# EAGLE board LLS16 (EAGLE 9.6.2), part 1 of 5
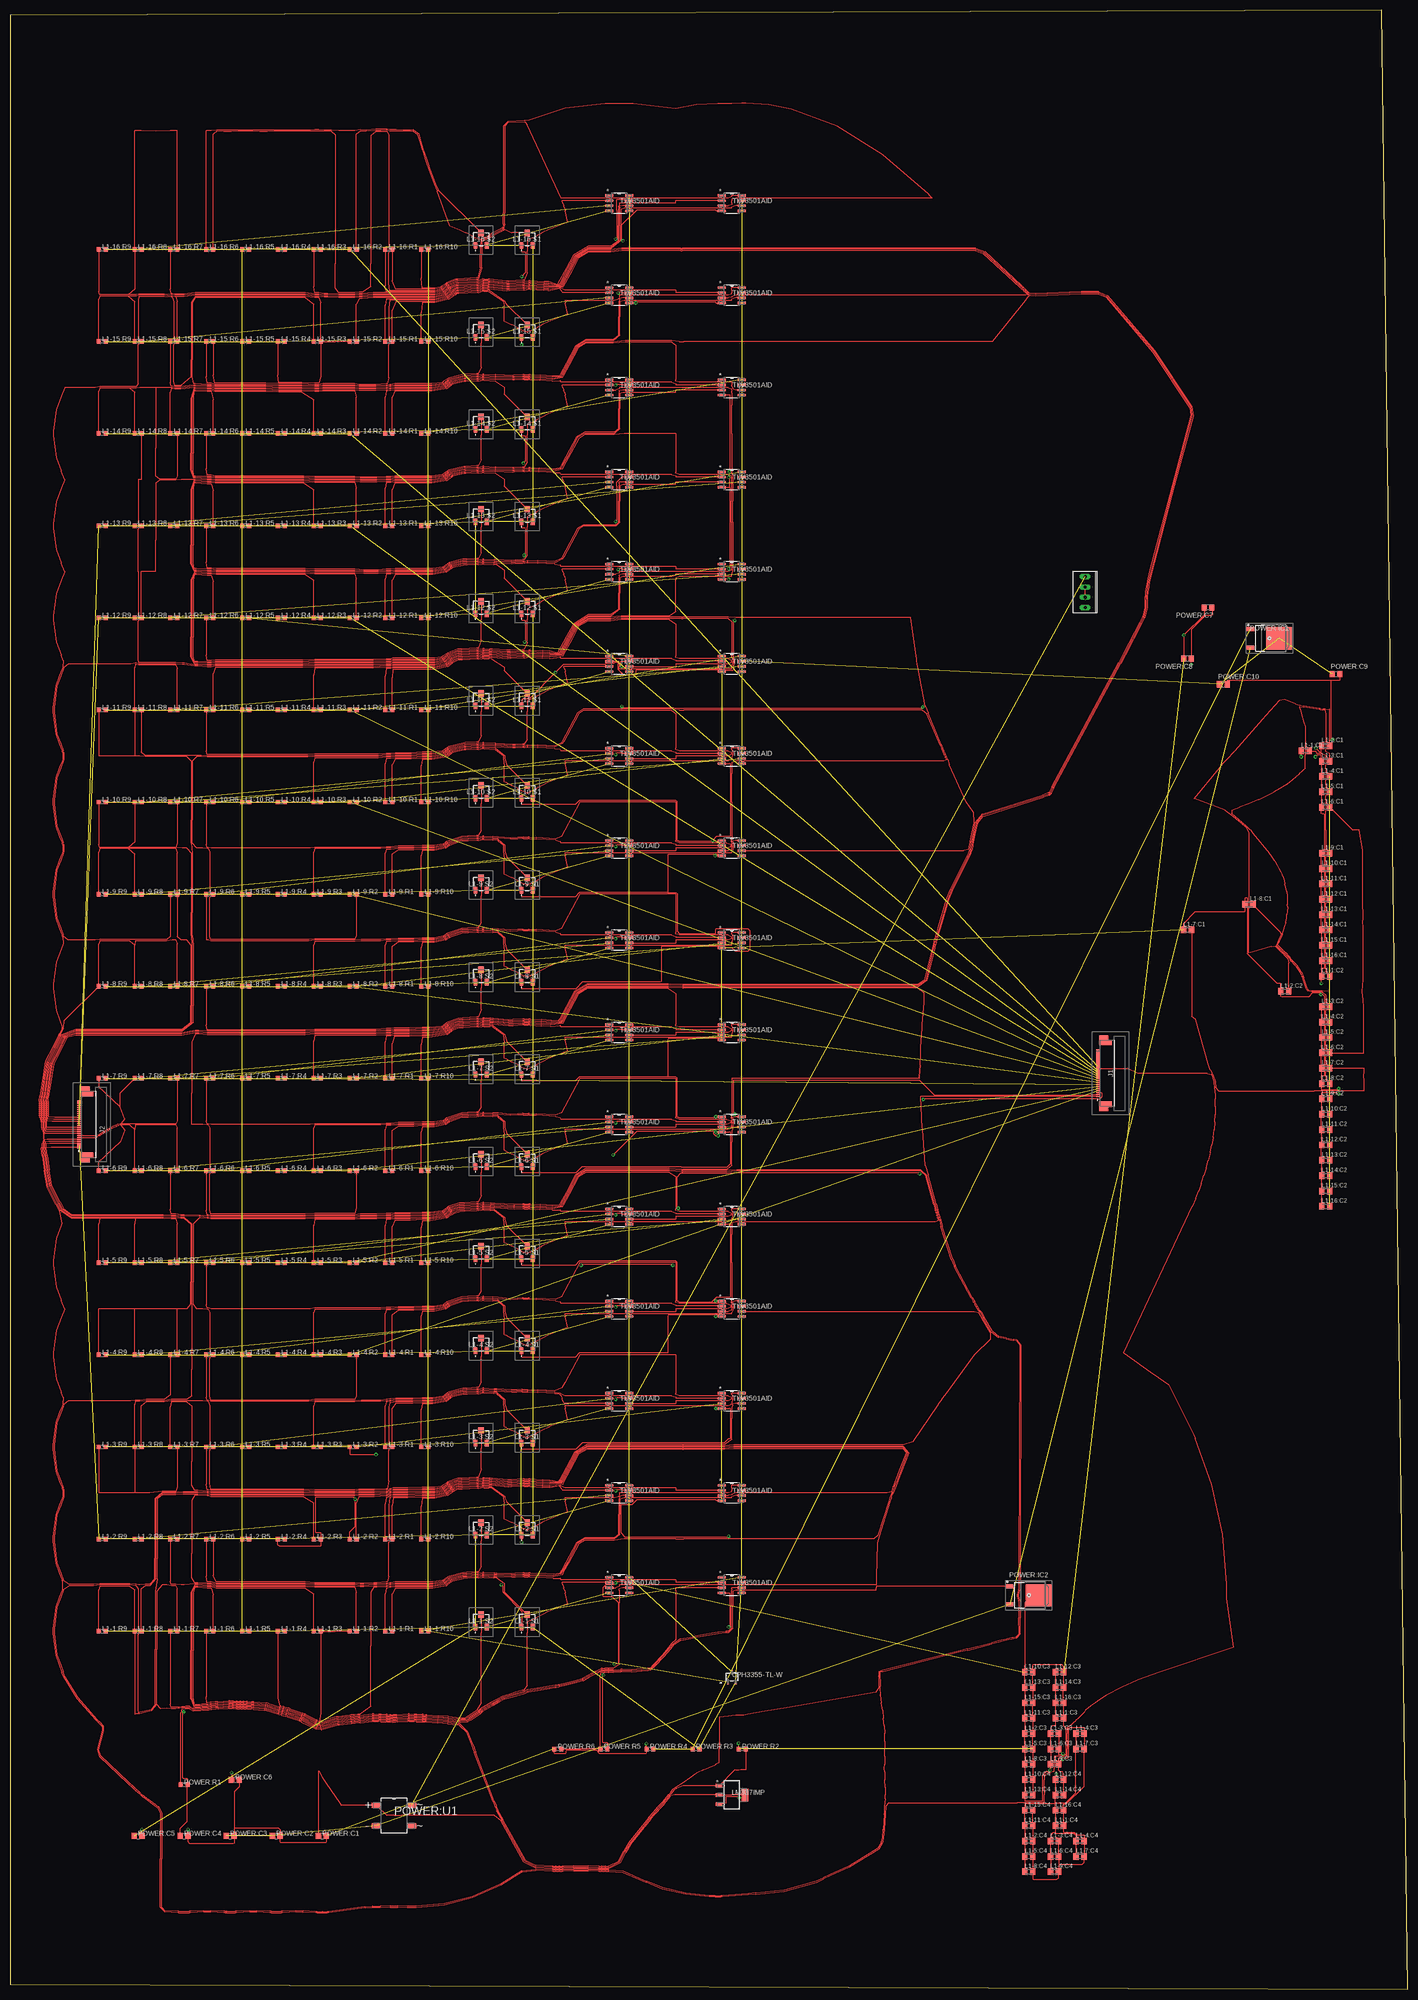
[diagram p3: board, top side]
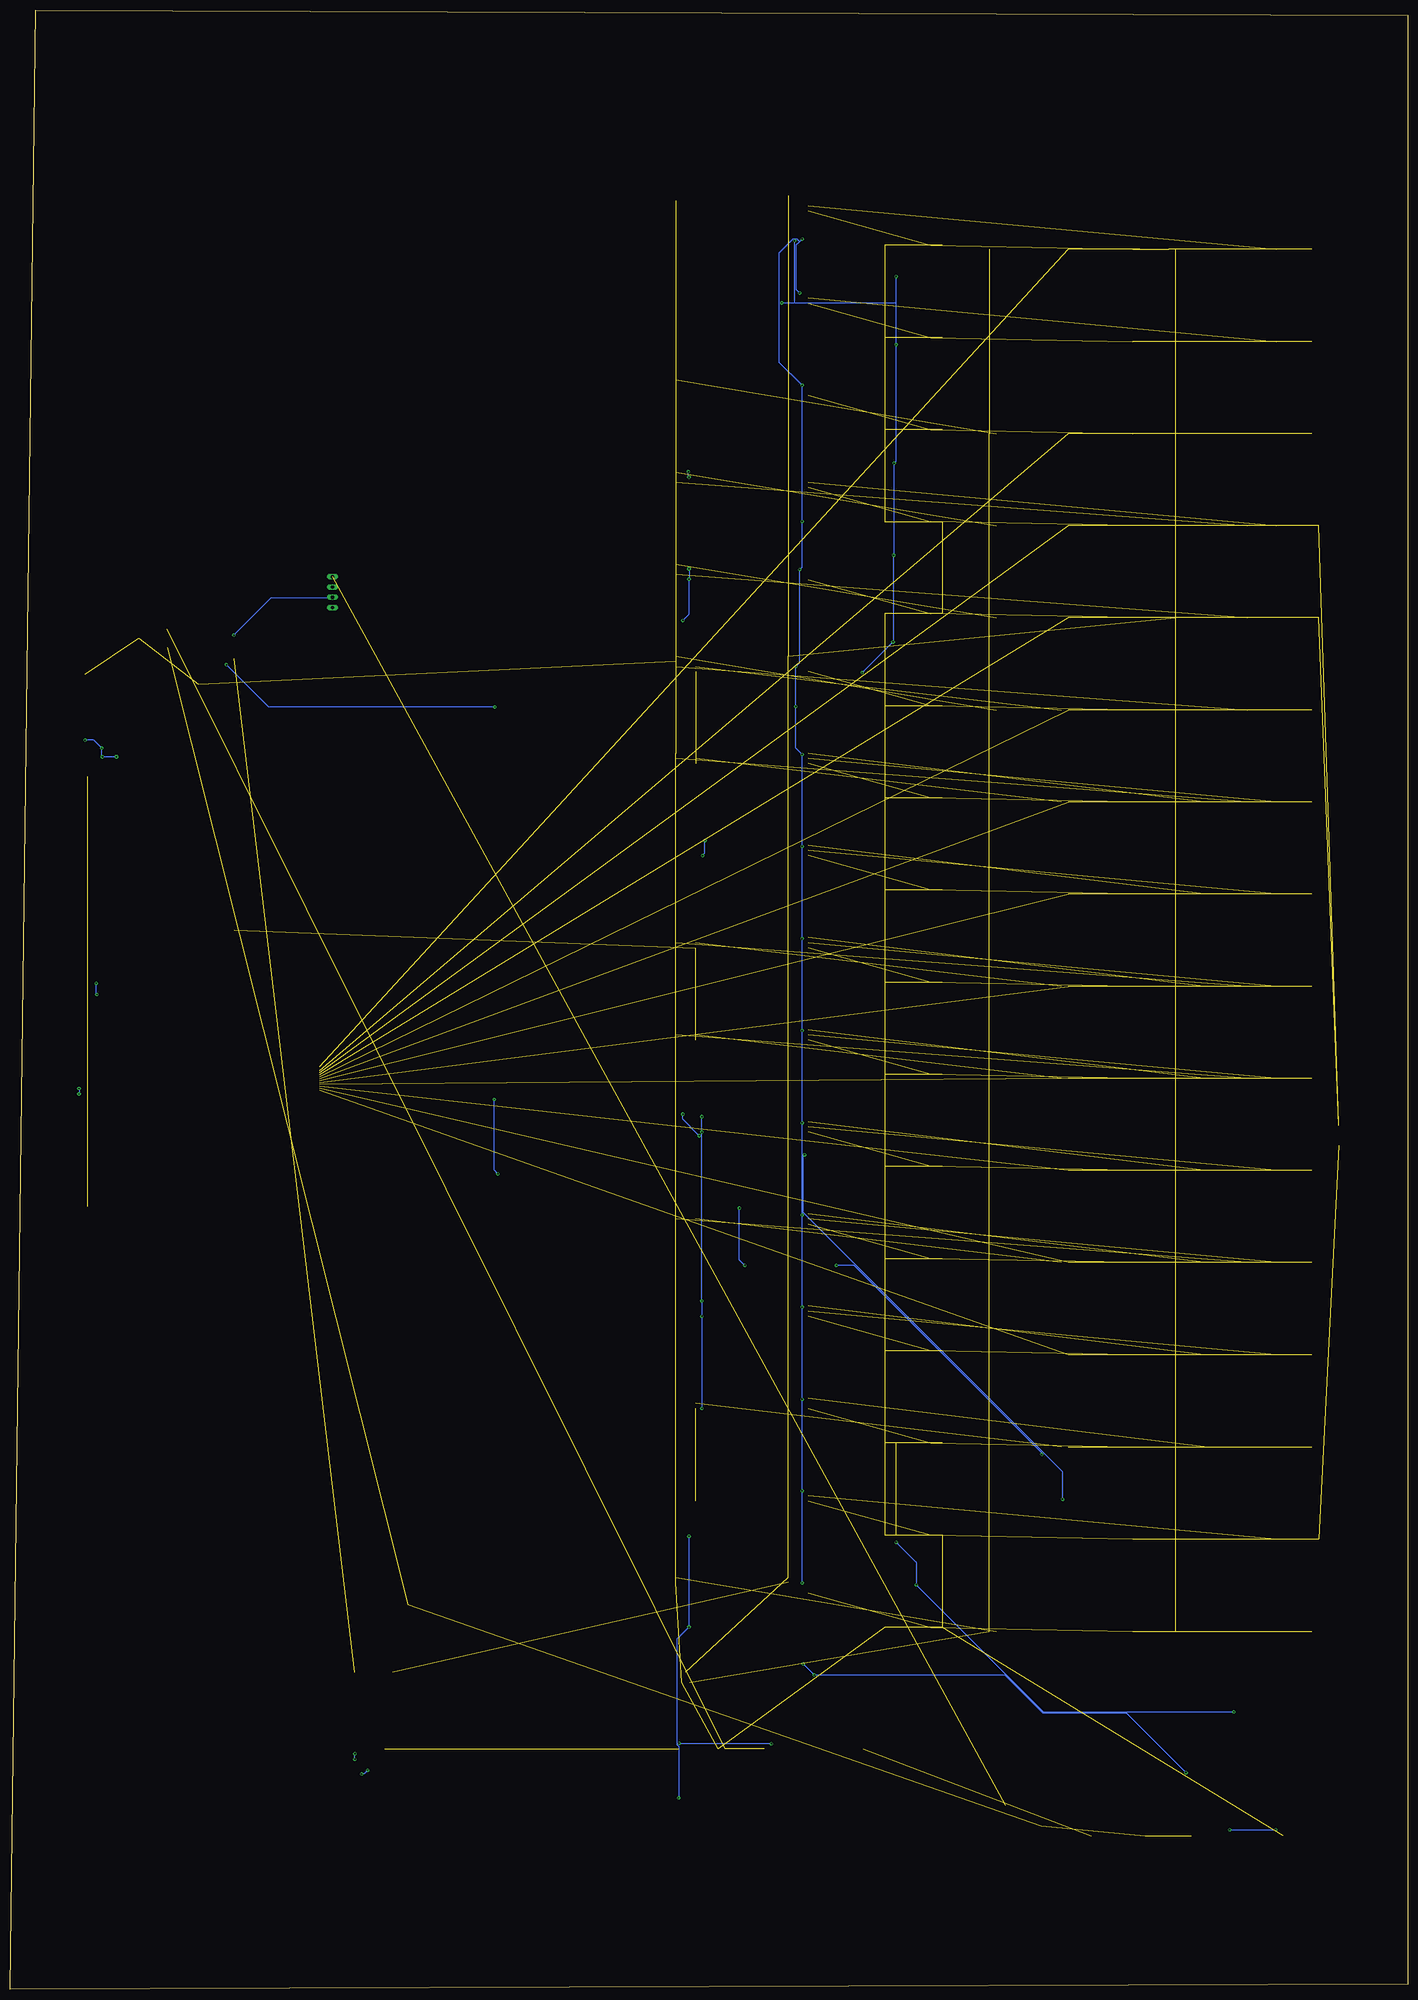
[diagram p4: board, bottom side, seen from below]

Size 346.69 x 491.16 mm. Coordinates in mm from the lower left corner, seen from the top.
Outline: 0,1.27 346.69,0 340.34,491.16 0,489.89 0,1.27
Copper layers (1*16): Top 0.035mm / dielectric 1.5mm / Bottom 0.035mm
Design rules "default": minimum track width 6mil, minimum drill 0.35mm, track to track 6mil, track to pad 6mil, pad to pad 6mil, via to via 6mil, smd to smd 6mil, copper to edge 40mil, drill to drill 6mil, minimum pad ring 10mil, minimum via ring 8mil, stop-mask expansion 4mil, vias tented up to drill 0mil, thermal gap 10mil

## Footprints (pad centres in the part's own frame; a part is rotated, then mirrored left to right if it is on the bottom)
0524372471 = smd 0.3 x 0.8: 1 -5.75,1.925; 2 -5.25,1.925; 3 -4.75,1.925; 4 -4.25,1.925; 5 -3.75,1.925; 6 -3.25,1.925; 7 -2.75,1.925; 8 -2.25,1.925; 9 -1.75,1.925; 10 -1.25,1.925; 11 -0.75,1.925; 12 -0.25,1.925; 13 0.25,1.925; 14 0.75,1.925; 15 1.25,1.925; 16 1.75,1.925; 17 2.25,1.925; 18 2.75,1.925; 19 3.25,1.925; 20 3.75,1.925; 21 4.25,1.925; 22 4.75,1.925; 23 5.25,1.925; 24 5.75,1.925 | smd 1.3 x 3.05: MP1 -7.65,0; MP2 7.65,0 | smd 1.1 x 2.2: MP3 -8.85,0.425; MP4 8.85,0.425
C0805K = smd 1.3 x 1.6: 1 -1,0; 2 1,0
R0603 = smd 1 x 1.1: 1 -0.85,0; 2 0.85,0
SM3TW102 = smd 0.9 x 1.6: 1 -1.4,-1.56; 3 1.4,-1.56 | smd 1.3 x 1.6: 2 0,1.56
D8 = smd 1.981 x 0.559: 1 -2.464,1.905; 2 -2.464,0.635; 3 -2.464,-0.635; 4 -2.464,-1.905; 5 2.464,-1.905; 6 2.464,-0.635; 7 2.464,0.635; 8 2.464,1.905
C0805 = smd 1.3 x 1.5: 1 -0.95,0; 2 0.95,0
TO228P991X238-3N = smd 1.75 x 1: 1 -4.7,2.285; 3 -4.7,-2.285 | smd 6.35 x 5.55: 4 2.4,0
SOT508P985X260-4N = smd 2.235 x 1.245: 1 -4.394,2.54; 2 -4.394,-2.54; 3 4.394,-2.54; 4 4.394,2.54
MP04A_TEX = smd 1.6 x 0.838: 1 -3.2,2.3; 2 -3.2,0; 3 -3.2,-2.3 | smd 1.6 x 3.048: 4 3.2,0
CPH3_2P9X1P6_ONS = smd 0.457 x 0.914: 1 -0.95,-1.295; 2 0.95,-1.295; 3 0,1.295
CONNHEADERVERT4POS2.54MM = drill 0.8 long: 1 0,0; 2 0,2.54; 3 0,5.08; 4 0,7.62

## Placement (x,y rotation side)
J1  0524372471  [0524372471]  271.78,227.33 90 top
J2  0524372471  [0524372471]  19.05,214.63 90 top
L1-1:C1  [C0805K]  321.31,307.34 0 top
L1-1:C2  [C0805K]  326.39,251.46 0 top
L1-1:C3  [C0805K]  260.35,67.31 0 top
L1-1:C4  [C0805K]  260.35,40.64 0 top
L1-1:R1  130  [R0603]  93.98,88.9 0 top
L1-1:R2  130  [R0603]  85.09,88.9 0 top
L1-1:R3  220  [R0603]  76.2,88.9 0 top
L1-1:R4  220  [R0603]  67.31,88.9 0 top
L1-1:R5  51  [R0603]  58.42,88.9 0 top
L1-1:R6  130  [R0603]  49.53,88.9 0 top
L1-1:R7  220  [R0603]  40.64,88.9 0 top
L1-1:R8  130  [R0603]  31.75,88.9 0 top
L1-1:R9  220  [R0603]  22.86,88.9 0 top
L1-1:R10  220  [R0603]  102.87,88.9 0 top
L1-1:S1  SM-3TW102  [SM3TW102]  128.27,91.44 0 top
L1-1:S2  SM-3TW102  [SM3TW102]  116.84,91.44 0 top
L1-1:U1  TLV3501AID  [D8]  179.07,100.33 0 top
L1-1:U2  TLV3501AID  [D8]  151.13,100.33 0 top
L1-2:C1  [C0805K]  326.39,308.61 0 top
L1-2:C2  [C0805K]  316.23,247.65 0 top
L1-2:C3  [C0805K]  252.73,63.5 0 top
L1-2:C4  [C0805K]  252.73,36.83 0 top
L1-2:R1  130  [R0603]  93.98,111.76 0 top
L1-2:R2  130  [R0603]  85.09,111.76 0 top
L1-2:R3  220  [R0603]  76.2,111.76 0 top
L1-2:R4  220  [R0603]  67.31,111.76 0 top
L1-2:R5  51  [R0603]  58.42,111.76 0 top
L1-2:R6  130  [R0603]  49.53,111.76 0 top
L1-2:R7  220  [R0603]  40.64,111.76 0 top
L1-2:R8  130  [R0603]  31.75,111.76 0 top
L1-2:R9  220  [R0603]  22.86,111.76 0 top
L1-2:R10  220  [R0603]  102.87,111.76 0 top
L1-2:S1  SM-3TW102  [SM3TW102]  128.27,114.3 0 top
L1-2:S2  SM-3TW102  [SM3TW102]  116.84,114.3 0 top
L1-2:U1  TLV3501AID  [D8]  179.07,123.19 0 top
L1-2:U2  TLV3501AID  [D8]  151.13,123.19 0 top
L1-3:C1  [C0805K]  326.39,304.8 0 top
L1-3:C2  [C0805K]  326.39,243.84 0 top
L1-3:C3  [C0805K]  259.08,63.5 0 top
L1-3:C4  [C0805K]  259.08,36.83 0 top
L1-3:R1  130  [R0603]  93.98,134.62 0 top
L1-3:R2  130  [R0603]  85.09,134.62 0 top
L1-3:R3  220  [R0603]  76.2,134.62 0 top
L1-3:R4  220  [R0603]  67.31,134.62 0 top
L1-3:R5  51  [R0603]  58.42,134.62 0 top
L1-3:R6  130  [R0603]  49.53,134.62 0 top
L1-3:R7  220  [R0603]  40.64,134.62 0 top
L1-3:R8  130  [R0603]  31.75,134.62 0 top
L1-3:R9  220  [R0603]  22.86,134.62 0 top
L1-3:R10  220  [R0603]  102.87,134.62 0 top
L1-3:S1  SM-3TW102  [SM3TW102]  128.27,137.16 0 top
L1-3:S2  SM-3TW102  [SM3TW102]  116.84,137.16 0 top
L1-3:U1  TLV3501AID  [D8]  179.07,146.05 0 top
L1-3:U2  TLV3501AID  [D8]  151.13,146.05 0 top
L1-4:C1  [C0805K]  326.39,300.99 0 top
L1-4:C2  [C0805K]  326.39,240.03 0 top
L1-4:C3  [C0805K]  265.43,63.5 0 top
L1-4:C4  [C0805K]  265.43,36.83 0 top
L1-4:R1  130  [R0603]  93.98,157.48 0 top
L1-4:R2  130  [R0603]  85.09,157.48 0 top
L1-4:R3  220  [R0603]  76.2,157.48 0 top
L1-4:R4  220  [R0603]  67.31,157.48 0 top
L1-4:R5  51  [R0603]  58.42,157.48 0 top
L1-4:R6  130  [R0603]  49.53,157.48 0 top
L1-4:R7  220  [R0603]  40.64,157.48 0 top
L1-4:R8  130  [R0603]  31.75,157.48 0 top
L1-4:R9  220  [R0603]  22.86,157.48 0 top
L1-4:R10  220  [R0603]  102.87,157.48 0 top
L1-4:S1  SM-3TW102  [SM3TW102]  128.27,160.02 0 top
L1-4:S2  SM-3TW102  [SM3TW102]  116.84,160.02 0 top
L1-4:U1  TLV3501AID  [D8]  179.07,168.91 0 top
L1-4:U2  TLV3501AID  [D8]  151.13,168.91 0 top
L1-5:C1  [C0805K]  326.39,297.18 0 top
L1-5:C2  [C0805K]  326.39,236.22 0 top
L1-5:C3  [C0805K]  252.73,59.69 0 top
L1-5:C4  [C0805K]  252.73,33.02 0 top
L1-5:R1  130  [R0603]  93.98,180.34 0 top
L1-5:R2  130  [R0603]  85.09,180.34 0 top
L1-5:R3  220  [R0603]  76.2,180.34 0 top
L1-5:R4  220  [R0603]  67.31,180.34 0 top
L1-5:R5  51  [R0603]  58.42,180.34 0 top
L1-5:R6  130  [R0603]  49.53,180.34 0 top
L1-5:R7  220  [R0603]  40.64,180.34 0 top
L1-5:R8  130  [R0603]  31.75,180.34 0 top
L1-5:R9  220  [R0603]  22.86,180.34 0 top
L1-5:R10  220  [R0603]  102.87,180.34 0 top
L1-5:S1  SM-3TW102  [SM3TW102]  128.27,182.88 0 top
L1-5:S2  SM-3TW102  [SM3TW102]  116.84,182.88 0 top
L1-5:U1  TLV3501AID  [D8]  179.07,191.77 0 top
L1-5:U2  TLV3501AID  [D8]  151.13,191.77 0 top
L1-6:C1  [C0805K]  326.39,293.37 0 top
L1-6:C2  [C0805K]  326.39,232.41 0 top
L1-6:C3  [C0805K]  259.08,59.69 0 top
L1-6:C4  [C0805K]  259.08,33.02 0 top
L1-6:R1  130  [R0603]  93.98,203.2 0 top
L1-6:R2  130  [R0603]  85.09,203.2 0 top
L1-6:R3  220  [R0603]  76.2,203.2 0 top
L1-6:R4  220  [R0603]  67.31,203.2 0 top
L1-6:R5  51  [R0603]  58.42,203.2 0 top
L1-6:R6  130  [R0603]  49.53,203.2 0 top
L1-6:R7  220  [R0603]  40.64,203.2 0 top
L1-6:R8  130  [R0603]  31.75,203.2 0 top
L1-6:R9  220  [R0603]  22.86,203.2 0 top
L1-6:R10  220  [R0603]  102.87,203.2 0 top
L1-6:S1  SM-3TW102  [SM3TW102]  128.27,205.74 0 top
L1-6:S2  SM-3TW102  [SM3TW102]  116.84,205.74 0 top
L1-6:U1  TLV3501AID  [D8]  179.07,214.63 0 top
L1-6:U2  TLV3501AID  [D8]  151.13,214.63 0 top
L1-7:C1  [C0805K]  292.1,262.89 0 top
L1-7:C2  [C0805K]  326.39,228.6 0 top
L1-7:C3  [C0805K]  265.43,59.69 0 top
L1-7:C4  [C0805K]  265.43,33.02 0 top
L1-7:R1  130  [R0603]  93.98,226.06 0 top
L1-7:R2  130  [R0603]  85.09,226.06 0 top
L1-7:R3  220  [R0603]  76.2,226.06 0 top
L1-7:R4  220  [R0603]  67.31,226.06 0 top
L1-7:R5  51  [R0603]  58.42,226.06 0 top
L1-7:R6  130  [R0603]  49.53,226.06 0 top
L1-7:R7  220  [R0603]  40.64,226.06 0 top
L1-7:R8  130  [R0603]  31.75,226.06 0 top
L1-7:R9  220  [R0603]  22.86,226.06 0 top
L1-7:R10  220  [R0603]  102.87,226.06 0 top
L1-7:S1  SM-3TW102  [SM3TW102]  128.27,228.6 0 top
L1-7:S2  SM-3TW102  [SM3TW102]  116.84,228.6 0 top
L1-7:U1  TLV3501AID  [D8]  179.07,237.49 0 top
L1-7:U2  TLV3501AID  [D8]  151.13,237.49 0 top
L1-8:C1  [C0805K]  307.34,269.24 0 top
L1-8:C2  [C0805K]  326.39,224.79 0 top
L1-8:C3  [C0805K]  252.73,55.88 0 top
L1-8:C4  [C0805K]  252.73,29.21 0 top
L1-8:R1  130  [R0603]  93.98,248.92 0 top
L1-8:R2  130  [R0603]  85.09,248.92 0 top
L1-8:R3  220  [R0603]  76.2,248.92 0 top
L1-8:R4  220  [R0603]  67.31,248.92 0 top
L1-8:R5  51  [R0603]  58.42,248.92 0 top
L1-8:R6  130  [R0603]  49.53,248.92 0 top
L1-8:R7  220  [R0603]  40.64,248.92 0 top
L1-8:R8  130  [R0603]  31.75,248.92 0 top
L1-8:R9  220  [R0603]  22.86,248.92 0 top
L1-8:R10  220  [R0603]  102.87,248.92 0 top
L1-8:S1  SM-3TW102  [SM3TW102]  128.27,251.46 0 top
L1-8:S2  SM-3TW102  [SM3TW102]  116.84,251.46 0 top
L1-8:U1  TLV3501AID  [D8]  179.07,260.35 0 top
L1-8:U2  TLV3501AID  [D8]  151.13,260.35 0 top
L1-9:C1  [C0805K]  326.39,281.94 0 top
L1-9:C2  [C0805K]  326.39,220.98 0 top
L1-9:C3  [C0805K]  259.08,55.88 0 top
L1-9:C4  [C0805K]  259.08,29.21 0 top
L1-9:R1  130  [R0603]  93.98,271.78 0 top
L1-9:R2  130  [R0603]  85.09,271.78 0 top
L1-9:R3  220  [R0603]  76.2,271.78 0 top
L1-9:R4  220  [R0603]  67.31,271.78 0 top
L1-9:R5  51  [R0603]  58.42,271.78 0 top
L1-9:R6  130  [R0603]  49.53,271.78 0 top
L1-9:R7  220  [R0603]  40.64,271.78 0 top
L1-9:R8  130  [R0603]  31.75,271.78 0 top
L1-9:R9  220  [R0603]  22.86,271.78 0 top
L1-9:R10  220  [R0603]  102.87,271.78 0 top
L1-9:S1  SM-3TW102  [SM3TW102]  128.27,274.32 0 top
L1-9:S2  SM-3TW102  [SM3TW102]  116.84,274.32 0 top
L1-9:U1  TLV3501AID  [D8]  179.07,283.21 0 top
L1-9:U2  TLV3501AID  [D8]  151.13,283.21 0 top
L1-10:C1  [C0805K]  326.39,278.13 0 top
L1-10:C2  [C0805K]  326.39,217.17 0 top
L1-10:C3  [C0805K]  252.73,78.74 0 top
L1-10:C4  [C0805K]  252.73,52.07 0 top
L1-10:R1  130  [R0603]  93.98,294.64 0 top
L1-10:R2  130  [R0603]  85.09,294.64 0 top
L1-10:R3  220  [R0603]  76.2,294.64 0 top
L1-10:R4  220  [R0603]  67.31,294.64 0 top
L1-10:R5  51  [R0603]  58.42,294.64 0 top
L1-10:R6  130  [R0603]  49.53,294.64 0 top
L1-10:R7  220  [R0603]  40.64,294.64 0 top
L1-10:R8  130  [R0603]  31.75,294.64 0 top
L1-10:R9  220  [R0603]  22.86,294.64 0 top
L1-10:R10  220  [R0603]  102.87,294.64 0 top
L1-10:S1  SM-3TW102  [SM3TW102]  128.27,297.18 0 top
L1-10:S2  SM-3TW102  [SM3TW102]  116.84,297.18 0 top
L1-10:U1  TLV3501AID  [D8]  179.07,306.07 0 top
L1-10:U2  TLV3501AID  [D8]  151.13,306.07 0 top
L1-11:C1  [C0805K]  326.39,274.32 0 top
L1-11:C2  [C0805K]  326.39,213.36 0 top
L1-11:C3  [C0805K]  252.73,67.31 0 top
L1-11:C4  [C0805K]  252.73,40.64 0 top
L1-11:R1  130  [R0603]  93.98,317.5 0 top
L1-11:R2  130  [R0603]  85.09,317.5 0 top
L1-11:R3  220  [R0603]  76.2,317.5 0 top
L1-11:R4  220  [R0603]  67.31,317.5 0 top
L1-11:R5  51  [R0603]  58.42,317.5 0 top
L1-11:R6  130  [R0603]  49.53,317.5 0 top
L1-11:R7  220  [R0603]  40.64,317.5 0 top
L1-11:R8  130  [R0603]  31.75,317.5 0 top
L1-11:R9  220  [R0603]  22.86,317.5 0 top
L1-11:R10  220  [R0603]  102.87,317.5 0 top
L1-11:S1  SM-3TW102  [SM3TW102]  128.27,320.04 0 top
L1-11:S2  SM-3TW102  [SM3TW102]  116.84,320.04 0 top
L1-11:U1  TLV3501AID  [D8]  179.07,328.93 0 top
L1-11:U2  TLV3501AID  [D8]  151.13,328.93 0 top
L1-12:C1  [C0805K]  326.39,270.51 0 top
L1-12:C2  [C0805K]  326.39,209.55 0 top
L1-12:C3  [C0805K]  260.35,78.74 0 top
L1-12:C4  [C0805K]  260.35,52.07 0 top
L1-12:R1  130  [R0603]  93.98,340.36 0 top
L1-12:R2  130  [R0603]  85.09,340.36 0 top
L1-12:R3  220  [R0603]  76.2,340.36 0 top
L1-12:R4  220  [R0603]  67.31,340.36 0 top
L1-12:R5  51  [R0603]  58.42,340.36 0 top
L1-12:R6  130  [R0603]  49.53,340.36 0 top
L1-12:R7  220  [R0603]  40.64,340.36 0 top
L1-12:R8  130  [R0603]  31.75,340.36 0 top
L1-12:R9  220  [R0603]  22.86,340.36 0 top
L1-12:R10  220  [R0603]  102.87,340.36 0 top
L1-12:S1  SM-3TW102  [SM3TW102]  128.27,342.9 0 top
L1-12:S2  SM-3TW102  [SM3TW102]  116.84,342.9 0 top
L1-12:U1  TLV3501AID  [D8]  179.07,351.79 0 top
L1-12:U2  TLV3501AID  [D8]  151.13,351.79 0 top
L1-13:C1  [C0805K]  326.39,266.7 0 top
L1-13:C2  [C0805K]  326.39,205.74 0 top
L1-13:C3  [C0805K]  252.73,74.93 0 top
L1-13:C4  [C0805K]  252.73,48.26 0 top
L1-13:R1  130  [R0603]  93.98,363.22 0 top
L1-13:R2  130  [R0603]  85.09,363.22 0 top
L1-13:R3  220  [R0603]  76.2,363.22 0 top
L1-13:R4  220  [R0603]  67.31,363.22 0 top
L1-13:R5  51  [R0603]  58.42,363.22 0 top
L1-13:R6  130  [R0603]  49.53,363.22 0 top
L1-13:R7  220  [R0603]  40.64,363.22 0 top
L1-13:R8  130  [R0603]  31.75,363.22 0 top
L1-13:R9  220  [R0603]  22.86,363.22 0 top
L1-13:R10  220  [R0603]  102.87,363.22 0 top
L1-13:S1  SM-3TW102  [SM3TW102]  128.27,365.76 0 top
L1-13:S2  SM-3TW102  [SM3TW102]  116.84,365.76 0 top
L1-13:U1  TLV3501AID  [D8]  179.07,374.65 0 top
L1-13:U2  TLV3501AID  [D8]  151.13,374.65 0 top
L1-14:C1  [C0805K]  326.39,262.89 0 top
L1-14:C2  [C0805K]  326.39,201.93 0 top
L1-14:C3  [C0805K]  260.35,74.93 0 top
L1-14:C4  [C0805K]  260.35,48.26 0 top
L1-14:R1  130  [R0603]  93.98,386.08 0 top
L1-14:R2  130  [R0603]  85.09,386.08 0 top
L1-14:R3  220  [R0603]  76.2,386.08 0 top
L1-14:R4  220  [R0603]  67.31,386.08 0 top
L1-14:R5  51  [R0603]  58.42,386.08 0 top
L1-14:R6  130  [R0603]  49.53,386.08 0 top
L1-14:R7  220  [R0603]  40.64,386.08 0 top
L1-14:R8  130  [R0603]  31.75,386.08 0 top
L1-14:R9  220  [R0603]  22.86,386.08 0 top
L1-14:R10  220  [R0603]  102.87,386.08 0 top
L1-14:S1  SM-3TW102  [SM3TW102]  128.27,388.62 0 top
L1-14:S2  SM-3TW102  [SM3TW102]  116.84,388.62 0 top
L1-14:U1  TLV3501AID  [D8]  179.07,397.51 0 top
L1-14:U2  TLV3501AID  [D8]  151.13,397.51 0 top
L1-15:C1  [C0805K]  326.39,259.08 0 top
L1-15:C2  [C0805K]  326.39,198.12 0 top
L1-15:C3  [C0805K]  252.73,71.12 0 top
L1-15:C4  [C0805K]  252.73,44.45 0 top
L1-15:R1  130  [R0603]  93.98,408.94 0 top
L1-15:R2  130  [R0603]  85.09,408.94 0 top
L1-15:R3  220  [R0603]  76.2,408.94 0 top
L1-15:R4  220  [R0603]  67.31,408.94 0 top
L1-15:R5  51  [R0603]  58.42,408.94 0 top
L1-15:R6  130  [R0603]  49.53,408.94 0 top
L1-15:R7  220  [R0603]  40.64,408.94 0 top
L1-15:R8  130  [R0603]  31.75,408.94 0 top
L1-15:R9  220  [R0603]  22.86,408.94 0 top
L1-15:R10  220  [R0603]  102.87,408.94 0 top
L1-15:S1  SM-3TW102  [SM3TW102]  128.27,411.48 0 top
L1-15:S2  SM-3TW102  [SM3TW102]  116.84,411.48 0 top
L1-15:U1  TLV3501AID  [D8]  179.07,420.37 0 top
L1-15:U2  TLV3501AID  [D8]  151.13,420.37 0 top
L1-16:C1  [C0805K]  326.39,255.27 0 top
L1-16:C2  [C0805K]  326.39,194.31 0 top
L1-16:C3  [C0805K]  260.35,71.12 0 top
L1-16:C4  [C0805K]  260.35,44.45 0 top
L1-16:R1  130  [R0603]  93.98,431.8 0 top
L1-16:R2  130  [R0603]  85.09,431.8 0 top
L1-16:R3  220  [R0603]  76.2,431.8 0 top
L1-16:R4  220  [R0603]  67.31,431.8 0 top
L1-16:R5  51  [R0603]  58.42,431.8 0 top
L1-16:R6  130  [R0603]  49.53,431.8 0 top
L1-16:R7  220  [R0603]  40.64,431.8 0 top
L1-16:R8  130  [R0603]  31.75,431.8 0 top
L1-16:R9  220  [R0603]  22.86,431.8 0 top
L1-16:R10  220  [R0603]  102.87,431.8 0 top
L1-16:S1  SM-3TW102  [SM3TW102]  128.27,434.34 0 top
L1-16:S2  SM-3TW102  [SM3TW102]  116.84,434.34 0 top
L1-16:U1  TLV3501AID  [D8]  179.07,443.23 0 top
L1-16:U2  TLV3501AID  [D8]  151.13,443.23 0 top
POWER:C1  10uF  [C0805]  77.47,38.1 0 top
POWER:C2  10uF  [C0805]  66.04,38.1 0 top
POWER:C3  10uF  [C0805]  54.61,38.1 0 top
POWER:C4  0.1uF  [C0805]  43.18,38.1 0 top
POWER:C5  0.1uF  [C0805]  31.75,38.1 0 top
POWER:C6  0.1uF  [C0805]  55.88,52.07 0 top
POWER:C7  0.1 uF  [C0805]  297.18,342.9 180 top
POWER:C8  2.2 uF  [C0805]  292.1,330.2 180 top
POWER:C9  0.1 uF  [C0805]  328.93,326.39 0 top
POWER:C10  2.2 uF  [C0805]  300.99,323.85 0 top
POWER:IC1  LM317AMDT_NOPB  [TO228P991X238-3N]  312.42,335.28 0 top
POWER:IC2  LM317AMDT_NOPB  [TO228P991X238-3N]  252.73,97.79 0 top
POWER:R1  240  [R0603]  43.18,50.8 0 top
POWER:R2  49.9  [R0603]  181.61,59.69 0 top
POWER:R3  240  [R0603]  170.18,59.69 0 top
POWER:R4  49.9  [R0603]  158.75,59.69 0 top
POWER:R5  240  [R0603]  147.32,59.69 0 top
POWER:R6  49.9  [R0603]  135.89,59.69 0 top
POWER:U1  DF10S  [SOT508P985X260-4N]  95.25,43.18 0 top
POWER:U2  LM337IMP  [MP04A_TEX]  179.07,48.26 0 top
U1  CPH3355-TL-W  [CPH3_2P9X1P6_ONS]  179.07,77.47 0 top
U$1  CONNHEADERVERT4POS2.54MM  [CONNHEADERVERT4POS2.54MM]  266.7,342.9 0 top

## Tracks (layer width: path | path; a pad name or v marks a point on that pad's centre or on a via)
+1.5V  (53 unrouted)
+3V  (via drill 0.35)  (1 unrouted)
  Top 0.152: L1-8:C4.1 251.71,29.26 251.71,32.92 L1-5:C4.1 251.71,33.07 251.71,36.73 L1-2:C4.1 251.71,36.88 251.71,40.54 L1-11:C4.1 251.71,40.69 251.71,44.35 L1-15:C4.1 251.71,44.5 251.71,46.02 259.33,46.02 | L1-9:C4.1 258.12,29.26 258.12,32.92 L1-6:C4.1 258.12,33.07 258.12,36.73 L1-3:C4.1 258.12,36.88 258.12,38.25 258.72,38.86 259.33,38.86 | L1-4:C3.1 264.36,63.4 264.36,59.74 L1-7:C3.1 264.36,59.59 264.36,48.77 261.93,46.33 259.33,46.33 | L1-7:C4.1 264.36,33.07 264.36,36.73 L1-4:C4.1 264.36,36.88 264.36,38.25 263.91,38.71 259.49,38.71 259.33,38.86 | 259.33,38.86 259.33,40.54 L1-1:C4.1 259.33,40.69 259.33,44.35 L1-16:C4.1 259.33,44.5 259.33,46.02 | 259.33,46.02 259.33,46.33 | 259.33,46.33 259.33,48.16 L1-14:C4.1 259.33,48.31 259.33,51.97 L1-12:C4.1 259.33,52.12 259.33,53.34 v259.49,53.49 | L1-12:C3.1 259.33,78.64 259.33,74.98 L1-14:C3.1 259.33,74.83 259.33,71.17 L1-16:C3.1 259.33,71.02 259.33,67.36 L1-1:C3.1 259.33,67.21 259.33,65.53 259.18,65.38 258.57,65.38 258.12,64.92 258.12,63.55 L1-3:C3.1 258.12,63.4 258.12,59.74 L1-6:C3.1 258.12,59.59 258.12,55.93 L1-9:C3.1 258.12,55.78 258.12,54.41 | POWER:IC2.4 255.07,97.84 253.69,97.84 251.87,96.01 251.87,80.62 251.71,80.47 251.71,78.79 L1-10:C3.1 251.71,78.64 251.71,74.98 L1-13:C3.1 251.71,74.83 251.71,71.17 L1-15:C3.1 251.71,71.02 251.71,67.36 L1-11:C3.1 251.71,67.21 251.71,63.55 L1-2:C3.1 251.71,63.4 251.71,59.74 L1-5:C3.1 251.71,59.59 251.71,55.93 L1-8:C3.1 251.71,55.78 251.71,52.12 L1-10:C4.1 251.71,51.97 251.71,48.31 L1-13:C4.1 251.71,48.16 251.71,46.79 256.13,46.79 256.13,53.19 257.05,54.1 257.81,54.1 258.12,54.41
  Top 0.152: 258.12,54.41 v257.96,54.41 | v150.82,420.93 151.13,421.23 151.74,421.23 151.89,421.08 153.57,421.08 L1-15:U2.7 | v150.22,434.34 150.37,434.34 150.52,434.49 150.52,441.5 150.37,441.66 150.37,443.94 150.52,444.09 152.2,444.09 152.35,443.94 153.57,443.94 L1-16:U2.7 | POWER:C7.1 298.2,342.9 298.2,341.07 298.04,340.92 296.52,340.92 293.01,337.41 293.01,330.25 POWER:C8.1 293.01,330.1 v293.01,328.73 | v147.17,78.03 146.86,77.72 146.86,61.42 147.01,61.27 148.08,61.27 148.23,61.11 148.23,59.74 POWER:R5.2 | v149.91,80.77 150.67,80.77 150.82,80.92 150.82,96.01 149.3,97.54 147.17,97.54 147.01,97.69 147.01,99.67 147.78,100.43 149.76,100.43 v150.22,100.89 150.52,101.19 152.2,101.19 152.35,101.04 153.57,101.04 L1-1:U2.7 | v54.97,53.8 54.97,52.12 POWER:C6.1 | v150.22,123.75 150.52,124.05 151.74,124.05 151.89,123.9 153.57,123.9 L1-2:U2.7 | v150.22,146.46 150.67,146.91 151.74,146.91 151.89,146.76 153.57,146.76 L1-3:U2.7 | v150.22,169.32 150.67,169.77 151.74,169.77 151.89,169.62 153.57,169.62 L1-4:U2.7 | v150.22,192.18 150.67,192.63 151.74,192.63 151.89,192.48 153.57,192.48 L1-5:U2.7 | v150.22,215.04 150.67,215.49 151.74,215.49 151.89,215.34 153.57,215.34 L1-6:U2.7 | v150.22,237.9 150.67,238.35 151.74,238.35 151.89,238.2 153.57,238.2 L1-7:U2.7 | v150.22,260.76 150.67,261.21 151.74,261.21 151.89,261.06 153.57,261.06 L1-8:U2.7 | v150.22,283.62 150.67,284.07 151.74,284.07 151.89,283.92 153.57,283.92 L1-9:U2.7 | v150.22,306.48 150.67,306.93 151.74,306.93 151.89,306.78 153.57,306.78 L1-10:U2.7 | v151.74,328.27 151.44,328.27 151.44,329.49 151.59,329.64 153.57,329.64 L1-11:U2.7
  Top 0.152: v150.82,352.35 151.13,352.65 151.74,352.65 151.89,352.5 153.57,352.5 L1-12:U2.7 | v150.22,364.24 150.52,364.24 150.67,364.39 150.67,372.92 150.52,373.08 150.52,373.99 151.89,375.36 153.57,375.36 L1-13:U2.7 | v150.22,398.07 150.52,398.37 151.74,398.37 151.89,398.22 153.57,398.22 L1-14:U2.7 | v226.42,318.21 226.42,318.06 226.26,317.91 164.85,317.91 164.69,318.06 152.04,318.06 v151.74,318.36
  Bottom 0.152: v259.49,53.49 258.88,53.49 v257.96,54.41 | v150.82,420.93 151.74,421.84 151.74,432.82 150.82,433.73 | v150.22,434.34 150.82,433.73 | v149.91,80.77 v147.17,78.03 99.92,78.03 90.47,68.58 69.75,68.58 v54.97,53.8 | v150.22,100.89 v150.22,123.75 v150.22,146.46 v150.22,169.32 v150.22,192.18 v150.22,215.04 v150.22,237.9 v150.22,260.76 v150.22,283.62 v150.22,306.48 151.74,308 v151.74,318.36 v151.74,328.27 150.82,329.18 v150.82,352.35 150.22,352.96 v150.22,364.24 v150.22,398.07 155.85,403.71 155.85,430.99 152.35,434.49 151.59,434.49 150.82,433.73 | v293.01,328.73 282.5,318.21 v226.42,318.21
+5V  (1 unrouted)
-1.5V  (via drill 0.35)  (5 unrouted)
  Top 0.152: v180.85,47.55 180.54,47.85 177.65,47.85 177.5,47.7 177.5,46.18 177.34,46.02 175.97,46.02 POWER:U2.3 | v178.26,89.92 178.41,89.92 178.56,90.07 178.56,98.3 178.41,98.45 176.73,98.45 L1-1:U1.4 | v178.26,112.47 177.95,112.17 152.65,112.17 151.59,113.23 151.59,120.24 151.74,120.4 154.33,120.4 155.55,121.62 174.9,121.62 175.21,121.31 176.58,121.31 L1-2:U1.4 | v178.26,349.91 176.73,349.91 L1-12:U1.4 | v178.26,352.5 178.41,352.5 178.56,352.65 178.56,372.62 178.41,372.77 | 178.41,372.77 176.73,372.77 L1-13:U1.4 | v178.41,376.58 178.71,376.58 178.71,395.63 176.73,395.63 L1-14:U1.4 | v178.26,375.21 178.41,375.21 178.56,375.06 178.56,372.92 178.41,372.77 | 177.19,327.36 155.4,327.36 155.25,327.2 155.25,326.29 155.09,326.14 152.2,326.14 150.82,327.51 150.82,329.18 149.91,329.18 149.76,329.03 147.78,329.03 147.47,328.73 137.26,328.73 v135.28,326.75 129.03,320.5 128.73,320.5 128.42,320.19 127.2,320.19 126.9,319.89 126.9,318.52 L1-11:S1.1 | 177.19,327.36 177.34,327.2 177.34,327.05 176.73,327.05 L1-11:U1.4 | v127.66,334.37 127.97,334.67 127.97,339.55 127.81,339.7 127.05,339.7 126.9,339.85 126.9,341.22 L1-12:S1.1 | v127.51,355.85 127.97,356.31 127.97,362.41 127.81,362.56 127.05,362.56 126.9,362.71 126.9,364.08 L1-13:S1.1 | v127.36,378.71 127.97,379.32 127.97,385.27 127.81,385.42 127.05,385.42 126.9,385.57 126.9,386.94 L1-14:S1.1 | v126.9,408.13 126.9,409.8 L1-15:S1.1 | v126.9,425.04 127.97,426.11 127.97,430.99 127.81,431.14 127.05,431.14 126.9,431.29 126.9,432.66 L1-16:S1.1 | v155.25,418.49 155.55,418.8 174.9,418.8 175.21,418.49 176.58,418.49 L1-15:U1.4
  Top 0.152: v152.04,433.88 151.74,434.19 151.74,437.85 155.55,441.66 174.9,441.66 175.21,441.35 176.58,441.35 L1-16:U1.4 | v179.78,339.7 179.48,339.4 179.48,330.25 179.63,330.1 179.63,328.73 179.48,328.57 179.48,327.51 179.17,327.2 179.02,327.36 177.19,327.36 | 163.17,226.47 141.22,226.47 140.16,225.4 127.05,225.4 126.9,225.55 126.9,226.92 L1-7:S1.1 | 163.17,226.47 163.17,235.76 163.32,235.91 177.19,235.91 177.34,235.76 177.34,235.61 176.73,235.61 L1-7:U1.4 | L1-6:S1.1 126.9,204.06 126.9,202.69 127.05,202.54 140.31,202.54 141.83,204.06 166.52,204.06 166.68,203.91 177.8,203.91 178.71,204.83 178.71,212.75 178.56,212.9 178.41,212.75 176.73,212.75 L1-6:U1.4 176.58,212.75 v175.06,212.75 | 163.17,226.47 165.15,226.47 165.46,226.16 165.46,216.56 165.61,216.41 165.91,216.41 166.06,216.26 174.75,216.26 v175.06,216.56 | L1-3:S1.1 126.9,135.48 126.9,134.11 127.05,133.96 140.31,133.96 141.99,135.64 177.19,135.64 178.1,136.55 178.56,136.55 178.71,136.7 178.71,144.17 178.56,144.32 178.41,144.17 176.73,144.17 L1-3:U1.4 176.58,144.17 v175.06,144.17 | L1-4:S1.1 126.9,158.34 126.9,156.97 127.05,156.82 140.16,156.82 141.22,157.89 163.17,157.89 163.17,167.18 163.32,167.33 177.19,167.33 177.34,167.18 177.34,167.03 176.73,167.03 L1-4:U1.4 176.58,167.03 v175.06,167.03 | 173.99,170.54 166.06,170.54 165.91,170.69 165.61,170.69 165.46,170.84 165.46,180.44 165.15,180.75 141.22,180.75 140.16,179.68 127.05,179.68 126.9,179.83 126.9,181.2 L1-5:S1.1 | 173.99,170.54 175.21,171.75 178.56,171.75 178.71,171.91 178.71,189.89 178.56,190.04 178.41,189.89 176.73,189.89 L1-5:U1.4
  Top 0.152: v175.06,170.84 175.06,170.69 174.9,170.54 173.99,170.54 | 327.76,324.76 329.74,324.76 329.89,324.92 329.89,326.29 POWER:C9.2 | 327.76,324.76 302.01,324.76 302.01,323.85 POWER:C10.2 | 325.32,297.18 325.32,293.37 | 325.32,304.8 325.32,300.99 | v320.29,305.87 320.29,307.24 L1-1:C1.1 | v323.8,305.87 324.26,306.32 325.32,306.32 325.32,304.8 | 325.32,304.8 L1-3:C1.1 | v323.95,308 324.87,307.09 325.32,307.09 325.32,308.61 L1-2:C1.1 | 325.32,300.99 325.32,297.18 | 325.32,297.18 L1-5:C1.1 | 325.32,300.99 L1-4:C1.1 | 325.32,278.13 325.32,274.32 | 325.32,278.13 325.32,281.94 L1-9:C1.1 | 325.32,278.13 L1-10:C1.1 | 325.32,270.51 325.32,266.7 | 325.32,255.27 325.32,253.44 | 325.32,253.44 325.32,251.46 | 325.32,262.89 325.32,259.08 | 325.32,259.08 325.32,255.27 | 325.32,255.27 L1-16:C1.1 | 325.32,259.08 L1-15:C1.1 | 325.32,262.89 325.32,266.7 | 325.32,266.7 L1-13:C1.1 | 325.32,262.89 L1-14:C1.1 | 325.32,270.51 325.32,274.32 | 325.32,274.32 L1-11:C1.1 | 325.32,270.51 L1-12:C1.1 | 325.32,293.37 325.32,291.85 325.48,291.69 325.93,291.69 326.08,291.54 326.08,253.44 325.32,253.44 | 325.32,293.37 L1-6:C1.1 | 327.76,324.76 327.76,310.29 v328.07,309.98 | 325.32,220.98 325.32,217.17 | 325.32,213.36 325.32,209.55 | 325.32,198.12 325.32,194.31 L1-16:C2.1 | 325.32,205.74 325.32,201.93 | 325.32,201.93 325.32,198.12 | 325.32,198.12 L1-15:C2.1 | 325.32,201.93 L1-14:C2.1 | 325.32,205.74 325.32,209.55 | 325.32,209.55 L1-12:C2.1 | 325.32,205.74 L1-13:C2.1 | 325.32,213.36 325.32,217.17 | 325.32,217.17 L1-10:C2.1 | 325.32,213.36 L1-11:C2.1 | L1-7:C1.1 291.03,262.89 291.03,264.41 293.93,267.31 306.12,267.31 306.27,267.46 306.27,269.14 L1-8:C1.1 306.27,269.29 306.27,270.66 306.43,270.81 306.88,270.81 307.03,270.66 307.03,257.25 306.88,257.1 314.35,249.63 315.11,249.63 315.26,249.48 315.26,247.65
  Top 0.152: 325.32,240.03 325.32,243.84 L1-3:C2.1 | 325.32,236.22 325.32,232.41 | 325.32,228.6 325.32,226.77 | 325.32,226.77 325.32,224.79 | 315.26,247.65 315.26,246.43 315.42,246.28 322.12,246.28 323.04,247.19 325.17,247.19 | 325.17,247.19 325.32,247.19 326.08,246.43 326.08,226.77 325.32,226.77 | 325.32,228.6 325.32,232.41 | 325.32,232.41 L1-6:C2.1 | 325.32,228.6 L1-7:C2.1 | 325.32,236.22 325.32,240.03 | 325.32,240.03 L1-4:C2.1 | 325.32,236.22 L1-5:C2.1 | 315.26,247.65 L1-2:C2.1 | 325.32,220.98 325.32,222.5 329.29,222.5 v329.59,222.2 | v329.59,223.57 329.59,223.42 329.44,223.27 325.32,223.27 325.32,224.79 | 325.32,220.98 L1-9:C2.1 | 325.32,224.79 L1-8:C2.1 | v325.32,249.63 325.32,251.46 | 325.17,247.19 v325.17,246.89 | 325.32,251.46 L1-1:C2.1 | POWER:C4.1 42.16,38.1 42.16,39.93 43.99,41.76 43.99,50.75 POWER:R1.2 43.99,50.9 43.99,52.27 43.84,52.43 42.93,52.43 42.77,52.58 42.77,68.58 v43.08,68.88 | v121.87,100.43 122.17,100.13 122.17,98.6 126.9,93.88 126.9,89.92 L1-1:S1.1 | v126.9,110.95 126.9,112.62 L1-2:S1.1 | L1-10:S1.1 126.9,295.5 126.9,294.13 127.05,293.98 140.16,293.98 141.22,295.05 165.15,295.05 165.46,294.74 165.46,285.14 165.61,284.99 165.91,284.99 166.06,284.84 173.99,284.84 v174.29,285.14 175.21,286.06 178.56,286.06 178.71,286.21 178.71,304.19 178.56,304.34 178.41,304.19 176.73,304.19 L1-10:U1.4 | 177.34,258.47 177.34,258.62 177.19,258.78 161.65,258.78 161.49,258.62 161.49,250.09 161.34,249.94 141.99,249.94 140.31,248.26 127.05,248.26 126.9,248.41 126.9,249.78 L1-8:S1.1 | 177.34,258.47 176.73,258.47 L1-8:U1.4 177.34,258.47 | 163.17,272.19 141.22,272.19 140.16,271.12 127.05,271.12 126.9,271.27 126.9,272.64 L1-9:S1.1
  Top 0.152: 163.17,272.19 163.17,281.48 163.32,281.63 177.19,281.63 177.34,281.48 177.34,281.33 176.73,281.33 L1-9:U1.4 176.58,281.33 v174.9,281.33 | 177.34,258.47 179.17,258.47 180.09,257.56 182.98,257.56 183.44,258.01 183.44,262.74 182.98,263.19 175.21,263.19 175.06,263.04 175.06,262.13 174.9,261.98 166.06,261.98 165.46,262.58 165.46,271.88 165.15,272.19 163.17,272.19
  Bottom 0.152: v180.85,47.55 180.85,60.35 181.31,60.81 181.31,86.87 v178.26,89.92 v178.26,112.47 | v178.26,352.5 v178.26,349.91 178.26,341.22 v179.78,339.7 | v178.41,376.58 178.41,375.36 v178.26,375.21 | v135.28,326.75 v127.66,334.37 127.51,334.52 v127.51,355.85 127.36,356.01 v127.36,378.71 126.9,379.17 v126.9,408.13 126.9,418.49 | 126.9,418.49 v126.9,425.04 | 126.9,418.49 152.04,418.49 | 152.04,418.49 v155.25,418.49 | 152.04,418.49 v152.04,433.88 | v175.06,216.56 v175.06,212.75 v175.06,170.84 v175.06,167.03 v175.06,144.17 | v320.29,305.87 v323.8,305.87 323.95,306.02 v323.95,308 325.93,309.98 v328.07,309.98 | v329.59,223.57 v329.59,222.2 | v325.32,249.63 325.32,247.04 v325.17,246.89 | v126.9,110.95 121.87,105.92 v121.87,100.43 90.32,68.88 v43.08,68.88 | v174.29,285.14 174.29,281.94 v174.9,281.33
D  (32 unrouted)
F1
  Top 0.152: 250.59,102.48 250.59,101.57 250.59,100.99 250.58,99.82 250.58,99.55 250.4,98.94 250.12,97.98 250.1,97.91 250.1,97.67 250.12,97.6 250.4,96.64 250.58,96.03 250.58,95.75 250.59,94.59 250.59,94.01 250.59,93.1 | 250.59,102.48 250.59,103.4 250.78,159.97 249.76,161.2 248.96,161.34 247.16,161.69 245.23,162.06 243.66,163.35 241.68,166.74 240.89,168.11 240.8,168.27 240.4,168.67 240.31,168.83 240.04,169.3 239.95,169.46 239.69,169.94 239.6,170.09 239.35,170.57 239.26,170.73 238.75,171.69 234.52,179.6 233.82,181.26 231.2,189.39 230.87,190.91 230.82,191.07 230.68,191.54 230.63,191.7 230.49,192.17 230.44,192.33 230.3,192.81 230.26,192.97 230.12,193.44 230.08,193.6 229.72,194.93 227.75,202.1 227.06,204.42 226.72,209.82 226.36,213.36 226.31,214 226.25,214.63 226.21,215.26 226.16,215.9 226.13,216.53 225.86,221.58 J1.1 | 250.59,93.1 250.59,92.18 250.6,88.25 249.57,87.06 248.93,86.97 248.5,86.88 247.62,86.71 247.19,86.63 245.32,86.15 243.55,85.7 237.55,84.18 235.78,83.73 216.56,78.87 215.78,78.77 215.78,78.76 215.8,77.83 215.81,77.75 215.82,76.5 215.82,76.34 215.81,75.26 215.81,75.09 215.81,74.89 215.81,74.85 215.82,73.05 215.83,73.03 216.15,71.12 216.44,69.22 216.65,67.31 216.83,65.41 216.94,63.5 217.01,61.59 217.02,59.69 217.01,57.78 216.94,55.88 216.89,54.86 216.95,53.97 217.03,52.07 217.08,50.16 217.07,48.26 217.08,47.27 216.91,45.45 216.9,45.37 216.84,43.54 216.84,43.47 216.73,41.65 216.72,41.56 216.56,39.74 216.55,39.66 216.34,37.85 216.32,37.76 216.16,36.6 216.12,36.35 215.28,35.07 208.04,30.54 203.38,28.43 201.72,27.68 200.04,26.91 192.05,24.68 184.96,23.92 183.14,23.75 176.66,23.23 176.27,23.23 174.96,23.25 173.44,23.27 167.68,23.86 161.92,25.19 157.92,26.89 156.24,27.61 152.08,29.38 148.51,29.63 148.34,29.63 147.74,29.63 147.53,29.63 146.89,29.63 146.68,29.63 146.22,29.63 145.96,29.63 143.42,29.73 139.79,29.74 137.25,29.65 136.99,29.65 136.31,29.65 136.1,29.65 135.47,29.65 135.25,29.65 134.79,29.65 134.53,29.65 130.39,29.87 126.94,29.44 121.55,26.11 114.61,23.05 107.68,21.21 100.75,20.61 98.53,20.62 96.17,20.72 94.33,20.72 91.97,20.63 91.77,20.63 89.94,20.63 89.87,20.64 88.03,20.52 79.06,19.32 78.75,19.32 77.51,19.32 77.49,19.32 76.56,19.32 76.54,19.32 76.19,19.32 75.88,19.32 72.68,19.51 70.83,19.51 67.64,19.34 67.31,19.34 66.08,19.34 66.06,19.34 65.13,19.34 65.11,19.34 64.76,19.34 64.44,19.34 61.25,19.53 59.4,19.53 56.21,19.36 55.88,19.36 54.65,19.36 54.63,19.36 53.7,19.36 53.68,19.36 53.34,19.36 53.01,19.36 49.82,19.55 47.97,19.56 44.78,19.38 44.46,19.38 43.22,19.38 43.2,19.38 42.27,19.38 42.25,19.38 41.91,19.39 41.59,19.39 38.39,19.57 37.62,20.39 37.62,32.42 37.62,34.25 37.62,37.19 37.62,39.01 37.62,41.95 37.62,43.3 37.62,43.73 36.82,45.31 36.08,45.86 33.44,47.83 33.12,48.08 32.47,48.6 32.15,48.86 32,48.99 31.19,49.74 31.05,49.87 30.77,50.14 30.63,50.27 29.31,51.54 22.31,58.09 21.91,59.45 23.12,64.23 23.13,65.43 23.05,65.52 22.32,66.25 22.22,66.35 21.87,66.7 21.62,66.94 16.93,72.31 13.58,77.66 13.16,78.78 12.52,80.5 11.58,83.01 10.91,88.36 10.91,88.62 10.91,89.17 10.91,89.44 11.59,94.85 12.52,97.3 13.17,99.01 13.22,99.14 14.73,100.18 20.79,100.18 22.22,100.33 22.44,100.33 23.07,100.33 23.28,100.33 24.93,100.33 26.09,100.33 28.52,100.33 29.68,100.33 31.11,100.18 31.32,100.18 31.75,99.42 31.75,89.75 31.75,88.9 31.75,88.05 31.75,69.39 31.93,68.68 32.14,68.73 33.45,69.06 34.97,69.42 36.04,70.77 36.04,84.39 36.04,86.22 36.04,87.99 36.04,89.81 36.04,91.58 36.04,93.41 36.04,98.81 36.5,101.85 36.5,106.95 36.5,109.38 36.5,110.54 36.5,112.98 36.5,114.14 36.5,116.57 36.5,121.67 37.72,122.73 38.27,122.73 40,122.73 40.22,122.73 40.85,122.73 41.06,122.73 43.01,122.88 43.26,122.88 45.82,122.88 46.55,122.88 48.89,122.73 49.1,122.73 49.74,122.58 49.96,122.58 50.96,122.58 51.54,122.58 54.55,122.58 55.13,122.58 57.78,122.58 58,122.58 58.63,122.58 58.84,122.58 59.85,122.58 60.43,122.58 63.44,122.58 64.02,122.58 66.67,122.58 66.88,122.58 67.52,122.58 67.73,122.58 68.74,122.58 69.32,122.58 72.33,122.58 72.91,122.58 75.56,122.43 75.78,122.43 76.41,122.43 76.62,122.43 77.78,122.43 78.51,122.43 81.38,122.43 82.11,122.43 84.45,122.43 84.66,122.43 85.3,122.43 85.52,122.43 86.52,122.58 87.1,122.58 89.96,122.58 90.39,122.58 93.34,122.73 93.55,122.73 94.19,123.04 94.41,123.04 95.1,123.19 95.38,123.19 98.55,123.19 98.67,123.19 102.23,123.34 102.44,123.34 103.08,123.34 103.3,123.34 104.55,123.34 105.38,123.34 107.69,123.82 108.05,124.07 108.85,124.62 109.28,124.91 111.15,125.59 112.08,125.65 115.78,125.87 116.14,125.88 117.2,126.05 117.55,126.04 118.9,125.97 119.53,125.93 123.5,125.49 124.44,125.55 127.22,125.72 127.57,125.73 128.62,125.74 128.97,125.73 132.1,125.55 133.88,125.44 136.79,125.53 137,125.91 138.73,129.14 140.74,132.87 143.16,134.31 146.84,134.31 148.98,134.31 149.3,134.31 151.45,134.31 151.76,134.31 155.42,134.31 161.29,134.31 163.19,134.31 163.27,134.31 166.93,134.31 167,134.31 168.91,134.31 174.78,134.31 176.92,134.31 177.24,134.31 179.54,134.47 180.01,134.47 183.06,134.47 189.53,134.47 192.58,134.47 221.62,134.47 222.6,133.2 220.9,128.78 220.03,126.5 219.93,126.23 219.37,124.78 219.31,124.62 219.14,124.14 219.08,123.98 218.91,123.51 218.85,123.35 218.54,122.92 218.49,122.76 218.33,122.29 218.27,122.13 217.94,121.09 215.28,112.68 214.23,111.76 191.06,111.76 181.53,111.76 179.07,111.76 176.61,111.76 167.08,111.76 165.1,111.76 163.12,111.76 153.59,111.76 152.35,111.76 149.91,111.46 149.88,111.46 147.45,111.46 142.55,111.46 141.02,110.54 138.44,105.74 137.29,103.59 136.94,102.93 134.79,102.37 131.18,102.6 128.97,102.72 128.62,102.73 127.58,102.72 127.22,102.71 125.36,102.6 124.39,102.54 120.73,102.69 120.06,102.73 117.54,102.87 117.19,102.88 116.14,102.72 115.8,102.71 113.32,102.56 112.36,102.5 109.45,101.8 109.02,101.5 108.22,100.96 107.86,100.71 104.91,100.18 104.31,100.18 103.3,100.18 103.08,100.18 102.44,100.18 102.23,100.18 99.89,100.18 99.16,100.18 96.29,100.18 95.56,100.18 94.41,100.03 94.19,100.03 93.55,99.87 93.34,99.87 91,99.72 90.27,99.72 89.53,98.5 89.53,92.5 89.53,88.9 89.53,85.31 89.53,70.2 86.72,68.3 86.28,68.27 85.41,68.19 85.2,68.17 84.53,68.09 84.32,68.07 81.38,67.66 80.94,67.59 77.71,66.73 77.23,66.59 76.67,66.43
  Top 0.152: 76.67,66.43 77.05,68.48 L1-1:R3.2 80.64,88.9 L1-1:R2.1 | L1-1:R4.1 66.46,72.19 66.94,70.42 67.15,70.37 67.82,70.19 68.04,70.12 68.97,69.84 69.46,69.69 72.51,68.67 72.66,68.6 73.08,68.39 73.36,68.25 76.05,66.93 76.26,66.82 76.85,66.52 76.99,66.44 76.61,66.41 76.67,66.43 | 250.59,102.48 | 250.59,93.1
F2  (via drill 0.35)
  Top 0.152: L1-2:R4.1 66.4,111.71 66.4,110.34 66.85,109.88 76.91,109.88 77.06,110.03 77.06,111.71 L1-2:R3.2 77.06,111.86 77.06,113.23 76.91,113.39 75.84,113.39 75.69,113.54 75.69,121.92 75.84,122.07 85.29,122.07 85.6,121.77 v85.6,121.62 85.6,114.91 84.23,113.54 84.23,111.86 L1-2:R2.1 | v179.78,217.17 179.48,217.47 179.48,225.7 225.5,225.7 229.31,221.89 268.02,221.89 268.17,222.05 269.85,222.05 J1.2 | v175.67,211.84 175.06,211.84 174.45,212.45 174.45,212.9 174.29,213.05 155.55,213.05 v149.61,207.11
  Bottom 0.152: v179.78,217.17 179.78,215.95 v175.67,211.84 | v149.61,207.11 149.91,206.81 149.91,192.79 85.6,128.47 v85.6,121.62
F3  (via drill 0.35)  (2 unrouted)
  Top 0.152: v226.57,220.83 226.87,221.13 269.85,221.13 270,220.98 270.31,220.98 270.92,221.59 270.92,222.35 270.76,222.5 270,222.5 J1.3 | v225.65,202.39 225.65,202.54 225.5,202.69 179.63,202.69 179.48,202.54 166.37,202.54 165.46,201.62 165.46,194.16 v165.76,193.85 | v164.39,179.68 164.39,179.83 164.24,179.98 141.99,179.98 v141.68,179.68 | v90.78,132.74 84.38,132.74 84.23,132.89 84.23,134.57 L1-3:R2.1
  Bottom 0.152: v226.57,220.83 226.57,203.3 v225.65,202.39 | v165.76,193.85 165.76,181.05 v164.39,179.68 | v141.68,179.68 137.26,179.68 90.78,133.2 v90.78,132.74
F4  (3 unrouted)
F5  (3 unrouted)
F6  (3 unrouted)
F7  (3 unrouted)
F8  (3 unrouted)
F9  (3 unrouted)
F10  (3 unrouted)
F11  (3 unrouted)
F12  (3 unrouted)
F13  (3 unrouted)
F14  (3 unrouted)
F15
  Top 0.152: L1-15:R3.2 77.05,400.25 76.62,398.58 76.41,398.58 75.78,398.58 75.56,398.58 72.3,398.73 72.03,398.73 68.71,398.73 68.43,398.73 67.73,398.73 67.52,398.73 66.88,398.73 66.67,398.73 66.46,400.56 L1-15:R4.1 | L1-15:R3.2 77.05,418.54 76.62,419.76 76.41,419.76 75.78,419.76 75.56,419.76 73.22,420.06 72.49,420.06 69.93,420.06 69.04,420.06 67.73,420.06 67.52,420.06 66.88,420.06 66.67,420.06 64.63,420.06 63.75,420.06 61.04,420.06 60.15,420.06 58.84,420.06 58.63,420.06 58,420.06 57.78,420.06 55.74,420.06 54.86,420.06 52.15,420.06 51.26,420.06 49.96,420.06 49.74,420.06 49.1,420.06 48.89,420.06 46.85,420.06 45.97,420.06 44.93,418.54 44.93,413.45 44.93,411.62 44.93,409.85 44.93,408.03 44.93,406.26 44.93,404.43 44.93,400.25 42.34,397.97 41.92,397.97 41.06,397.97 40.85,397.97 40.64,399.03 40.64,408.09 40.64,408.94 40.64,409.79 40.64,418.85 40.22,419.91 40,419.91 38.27,420.06 37.41,420.06 34.98,420.06 33.82,420.06 32.18,420.06 31.96,420.06 31.75,419.15 31.75,409.79 31.75,408.94 31.75,408.09 31.75,398.42 31.32,397.66 31.11,397.66 29.68,397.66 28.22,397.66 26.39,397.66 24.62,397.66 23.28,397.66 23.07,397.66 22.44,397.66 22.22,397.66 21.1,397.51 13.51,397.51 12.7,395.39 11.44,392.07 10.75,386.63 10.75,386.08 10.75,385.53 11.44,380.09 12.7,376.77 13.51,374.65 12.7,372.53 11.44,369.21 10.75,363.77 10.75,363.22 10.75,362.67 11.44,357.23 12.7,353.91 13.51,351.79 12.7,349.67 11.44,346.35 10.75,340.91 10.75,340.36 10.75,339.81 11.44,334.37 12.7,331.05 13.18,329.79 13.04,328.13 12.88,327.72 12.23,326.01 11.29,323.53 10.6,318.06 10.6,317.78 10.6,317.23 10.6,316.94 11.29,311.47 12.23,308.99 12.88,307.28 13.04,306.87 13.04,305.27 12.88,304.86 12.23,303.15 11.29,300.67 10.6,295.2 10.6,294.92 10.6,294.37 10.6,294.08 11.29,288.61 12.23,286.13 12.88,284.42 13.04,284.01 13.04,282.41 12.88,282 12.23,280.29 11.29,277.81 10.6,272.34 10.6,272.06 10.6,271.5 10.6,271.22 11.29,265.75 12.23,263.27 12.88,261.56 13.04,261.15 13.18,259.5 12.7,258.23 11.44,254.91 10.75,249.47 10.75,248.92 10.75,248.37 11.44,242.93 12.38,240.47 12.88,238.7 12.96,238.5 12.15,237.1 11.95,236.68 10.53,233.85 8.76,230.34 8.19,227.08 7.4,221.58 7.3,220.59 7.3,220.33 7.3,220 7.3,219.88 7.3,219.5 7.3,219.38 7.3,219 7.3,218.88 7.3,218.5 7.3,218.38 7.3,218 7.3,217.88 7.3,217.5 7.3,217.38 7.3,217 7.3,216.88 7.3,216.51 7.3,216.44 7.45,216.32 7.45,216.25 7.45,216.01 7.45,215.94 7.6,215.82 7.6,215.75 7.6,215.51 7.6,215.44 7.75,215.32 7.75,215.25 7.75,215.01 7.75,214.94 7.75,214.82 7.75,214.75 7.75,214.51 7.75,214.44 7.75,214.32 7.75,214.25 7.75,214.01 7.75,213.94 7.91,213.82 7.91,213.75 7.91,213.51 7.91,213.44 8.06,213.32 8.06,213.25 8.06,213 8.06,212.94 8.21,212.82 8.21,212.75 8.21,212.5 8.21,212.44 8.36,212.25 8.36,212.13 8.36,211.88 8.36,211.63 8.36,211.38 8.36,211.13 8.36,211 8.21,210.82 8.21,210.75 8.21,210.5 8.21,210.44 8.06,210.32 8.06,210.25 8.06,210 8.06,209.94 7.91,209.82 7.91,209.75 7.91,209.51 7.91,209.44 7.91,209.32 7.91,209.25 7.91,209.01 7.91,208.94 7.75,208.8 7.75,208.7 7.96,206.82 8.48,203.16 9.19,199.06 11.35,194.8 12.18,193.18 12.18,193.17 12.86,190.06 12.7,189.65 11.44,186.33 10.75,180.89 10.75,180.34 10.75,179.79 11.44,174.35 12.7,171.03 13.51,168.91 12.7,166.79 11.44,163.47 10.75,158.03 10.75,157.48 10.75,156.93 11.44,151.49 12.7,148.17 13.18,146.91 13.04,145.25 12.88,144.84 12.23,143.13 11.29,140.65 10.6,135.18 10.6,134.9 10.6,134.34 10.6,134.06 11.29,128.59 12.23,126.11 12.88,124.4 13.04,123.99 13.04,122.39 12.88,121.98 12.23,120.27 11.29,117.79 10.6,112.32 10.6,112.03 10.6,111.48 10.6,111.2 11.29,105.73 12.23,103.25 12.88,101.54 12.93,101.42 12.93,99.24 12.88,99.12 12.23,97.41 11.29,94.93 10.6,89.46 10.6,89.17 10.6,88.62 10.6,88.34 11.28,82.94 12.23,80.39 12.88,78.68 13.31,77.53 16.68,72.13 21.4,66.74 21.65,66.48 22,66.13 22.1,66.03 22.84,65.3 22.92,65.22 22.82,64.31 21.62,59.52 22.11,57.86 29.1,51.31 30.42,50.05 30.56,49.92 30.84,49.65 30.98,49.52 31.8,48.76 31.95,48.63 32.28,48.37 32.93,47.84 33.26,47.58 35.9,45.62 36.64,45.07 37.31,43.73 37.31,43.3 37.31,41.95 37.31,39.01 37.31,37.19 37.31,34.25 37.31,32.42 37.31,20.39 38.37,19.27 41.57,19.08 41.91,19.08 42.25,19.08 42.27,19.08 43.2,19.08 43.22,19.08 44.46,19.08 44.78,19.08 47.99,19.25 49.8,19.25 53,19.06 53.34,19.06 53.68,19.06 53.7,19.06 54.63,19.06 54.65,19.06 55.88,19.05 56.21,19.05 59.42,19.23 61.23,19.23 64.44,19.04 64.76,19.04 65.11,19.04 65.13,19.04 66.06,19.04 66.07,19.04 67.31,19.03 67.64,19.03 70.85,19.21 72.66,19.21 75.87,19.02 76.19,19.02 76.54,19.02 76.56,19.02 77.49,19.02 77.5,19.02 78.75,19.01 79.08,19.01 88.07,20.22 89.87,20.33 89.94,20.33 91.77,20.32 91.98,20.32 94.34,20.42 96.16,20.41 98.52,20.31 100.77,20.31 107.74,20.91 114.71,22.76 121.69,25.84 127.1,29.18 130.37,29.57 134.52,29.35 134.79,29.35 135.25,29.35 135.47,29.35 136.1,29.35 136.31,29.35 136.99,29.34 137.25,29.34 139.8,29.43 143.41,29.43 145.96,29.33 146.22,29.33 146.68,29.33 146.89,29.33 147.53,29.33 147.74,29.32 148.34,29.33 148.51,29.33 151.96,29.1 156.12,27.33 157.8,26.61 161.83,24.9 167.63,23.56 173.42,22.97 174.95,22.94 176.27,22.93 176.68,22.93 183.16,23.45 184.99,23.62 192.1,24.38 200.14,26.63 201.84,27.4 203.51,28.15 208.18,30.27 215.44,34.81 216.42,36.31 216.46,36.56 216.63,37.71 216.64,37.81 216.85,39.63 216.86,39.71 217.03,41.54 217.03,41.62 217.14,43.45 217.15,43.53 217.21,45.36 217.21,45.44 218,46.35 249.82,46.35 251.73,46.35 252.73,46.35 253.73,46.35 255.63,46.35 256.54,46.35 256.54,48.26 256.54,50.16 256.54,52.07 256.54,53.1 257.43,53.61 257.73,53.7 258.08,53.8 258.7,53.97 258.73,53.97 259.08,54 259.08,54.88 259.08,55.88 259.08,56.88 259.08,57.78 260.08,57.78 261.99,57.78 262.25,57.78 262.25,59.69 262.25,61.59 262.25,63.5 262.25,64.89 262.69,65.24 263.09,65.57 263.78,66.12 264.21,66.51 264.43,66.73 265.01,67.31 265.43,67.71 265.81,68.11 266.43,68.81 266.79,69.22 268.11,70.32 269.18,71.12 270.25,71.92 271.91,73.03 275.73,74.93 279.67,76.74 279.88,76.84 285.13,78.74 303.62,84.95 301.87,97.1 301.86,97.79 301.85,100.56 300.88,112.95 298.15,125.32 294.02,136.68 293.66,137.66 287.4,149.99 283.7,152.62 276.28,157.93 293.26,194.31 294.1,196.22 294.84,198.12 295.54,200.03 295.79,200.78 296.17,201.93 296.79,203.83 297.3,205.74 297.77,207.64 298.14,209.55 298.48,211.45 298.7,213.36 298.9,215.26 298.98,217.17 299.03,219.07 299.01,220.98 298.99,221.97 298.75,223.78 298.74,223.87 298.65,225.03 298.62,225.28 298.07,226.89 297.95,227.07 297.05,227.33 279.81,227.33 279.25,227.58 278.7,227.83 278.19,228.08 277.68,228.33 277.2,228.58 J1.15
  Top 0.152: L1-15:R3.2 80.64,408.94 L1-15:R2.1
F16  (3 unrouted)
G  (16 unrouted)
GND  (via drill 0.35)  (3 unrouted)
  Top 0.152: POWER:R6.1 134.98,59.59 134.98,58.67 135.13,58.52 137.72,58.52 137.87,58.67 137.87,59.13 138.02,59.28 145.49,59.28 146.25,58.52 157.68,58.52 157.84,58.67 157.84,59.59 POWER:R4.1 157.84,59.74 v157.84,60.96 | v180.7,61.11 180.7,59.74 POWER:R2.1 | L1-3:C3.2 260.1,63.4 260.1,59.74 L1-6:C3.2 260.1,59.59 260.1,58.22 261.16,58.22 | 261.16,58.22 261.93,58.22 261.93,64.92 261.31,65.53 261.31,67.21 L1-1:C3.2 261.31,67.36 261.31,71.02 L1-16:C3.2 261.31,71.17 261.31,74.83 L1-14:C3.2 261.31,74.98 261.31,78.64 L1-12:C3.2 261.31,78.79 261.31,80.16 260.86,80.62 253.85,80.62 253.69,80.47 253.69,78.79 L1-10:C3.2 253.69,78.64 253.69,74.98 L1-13:C3.2 253.69,74.83 253.69,71.17 L1-15:C3.2 253.69,71.02 253.69,67.36 L1-11:C3.2 253.69,67.21 253.69,63.55 L1-2:C3.2 253.69,63.4 253.69,59.74 L1-5:C3.2 253.69,59.59 253.69,55.93 L1-8:C3.2 253.69,55.78 253.69,52.12 L1-10:C4.2 253.69,51.97 253.69,48.31 L1-13:C4.2 | L1-14:C4.2 261.31,48.31 261.31,51.97 L1-12:C4.2 261.31,52.12 261.31,53.8 261.16,53.95 260.55,53.95 260.1,54.41 260.1,55.78 L1-9:C3.2 260.1,55.93 260.1,57.45 261.16,57.45 | 261.16,57.45 262.38,57.45 262.69,57.76 262.69,64.77 262.99,65.08 266.34,65.08 266.5,64.92 266.5,63.55 L1-4:C3.2 266.5,63.4 266.5,59.74 L1-7:C3.2 266.5,59.59 266.5,50.44 262.08,46.02 261.47,46.02 261.31,45.87 261.31,44.5 L1-16:C4.2 261.31,44.35 261.31,40.69 L1-1:C4.2 261.31,40.54 261.31,39.17 261.47,39.01 264.06,39.01 264.67,38.41 266.34,38.41 266.5,38.25 266.5,36.88 L1-4:C4.2 266.5,36.73 266.5,33.07 L1-7:C4.2 266.5,32.92 266.5,31.55 266.04,31.09 260.1,31.09
  Top 0.152: 260.1,31.09 260.1,32.92 L1-6:C4.2 260.1,33.07 260.1,36.73 L1-3:C4.2 | 260.1,31.09 260.1,29.26 L1-9:C4.2 260.1,29.11 260.1,27.74 259.64,27.28 253.85,27.28 253.69,27.43 253.69,29.11 L1-8:C4.2 253.69,29.26 253.69,32.92 L1-5:C4.2 253.69,33.07 253.69,36.73 L1-2:C4.2 253.69,36.88 253.69,40.54 L1-11:C4.2 253.69,40.69 253.69,44.35 L1-15:C4.2 | v261.16,58.52 261.16,58.22 | 261.16,57.45 v261.16,57.15 | U$1.2 266.65,345.49 266.65,347.93 U$1.3 | POWER:C8.2 291.19,330.25 v291.19,336.04 296.22,341.07 296.22,342.9 POWER:C7.2 | v32.72,39.62 32.72,38.1 POWER:C5.2 | 44.15,38.1 v44.15,39.62 | 67,38.1 67,36.58 67.16,36.42 78.28,36.42 78.44,36.58 78.44,38.1 POWER:C1.2 | 55.57,40.08 55.57,49.07 56.79,50.29 56.79,51.97 POWER:C6.2 | 55.57,40.08 55.57,38.1 | 67,38.1 67,39.62 66.55,40.08 55.57,40.08 | 67,38.1 POWER:C2.2 | 44.15,38.1 44.15,36.58 44.6,36.12 55.42,36.12 55.57,36.27 55.57,38.1 | 44.15,38.1 POWER:C4.2 | 55.57,38.1 POWER:C3.2
  Bottom 0.152: v180.7,61.11 180.54,60.96 v157.84,60.96 | v261.16,57.15 v261.16,58.52 | v291.19,336.04 281.89,345.34 266.8,345.34 U$1.2 | v44.15,39.62 v32.72,39.62
L1-1:+1.5
  Top 0.152: L1-1:C1.2 324,307.34 324.02,307.25 324.19,306.71 325.39,306.71 325.48,306.71 326.39,306.25 326.39,305.8 326.39,304.8 326.39,303.8 326.39,302.9 326.39,301.99 326.39,300.99 326.39,299.99 326.39,299.09 326.39,298.18 326.39,297.18 326.39,296.18 326.39,295.28 326.39,294.37 326.39,293.37 326.39,292.37 326.39,287.66 326.39,282.94 326.39,281.94 326.39,280.94 326.39,280.04 326.39,279.13 326.39,278.13 326.39,277.13 326.39,276.23 326.39,275.32 326.39,274.32 326.39,273.32 326.39,272.42 326.39,271.51 326.39,270.51 326.39,269.51 326.39,268.61 326.39,267.7 326.39,266.7 326.39,265.7 326.39,264.8 326.39,263.89 326.39,262.89 326.39,261.89 326.39,260.99 326.39,260.08 326.39,259.08 326.39,258.08 326.39,257.18 326.39,256.27 326.39,255.27 326.39,254.27 326.39,253.36 326.39,252.46 L1-1:C2.2
L1-1:GND!  (4 unrouted)
L1-1:N$1
  Top 0.152: L1-1:R1.2 94.83,98.2 95.56,99.57 96.29,99.57 99.16,99.57 99.89,99.57 102.23,99.57 102.44,99.57 103.08,99.57 103.3,99.57 104.31,99.57 104.91,99.57 108.2,100.21 108.57,100.46 109.36,101 109.79,101.3 112.4,101.89 113.36,101.95 115.81,102.1 116.16,102.11 117.17,102.27 117.52,102.26 120.03,102.12 120.69,102.08 122.55,100.75 122.55,98.72 L1-1:S1.2
L1-1:N$2
  Top 0.152: L1-1:R1.1 93.13,98.2 93.34,99.57 93.55,99.57 94.19,99.72 94.41,99.72 95.56,99.87 96.29,99.87 99.16,99.87 99.89,99.87 102.23,99.87 102.44,99.87 103.08,99.87 103.3,99.87 104.31,99.87 104.91,99.87 108.03,100.46 108.4,100.71 109.19,101.25 109.62,101.55 112.38,102.19 113.34,102.26 115.8,102.4 116.16,102.41 117.18,102.58 117.53,102.57 120.05,102.43 120.71,102.39 124.41,102.23 125.38,102.3 127.23,102.4 127.58,102.41 128.61,102.43 128.95,102.41 131.16,102.29 134.77,102.06 136.5,102.01 136.68,101.6 148.03,101.6 148.67,101.6 149.3,101.6 151.13,101.6 152.96,101.6 153.59,101.6 154.23,101.6 165.1,101.6 165.1,100.97 L1-1:U1.2
L1-1:N$3
  Top 0.152: L1-1:R2.2 85.94,98.5 85.52,99.72 85.3,99.72 84.66,99.72 84.45,99.72 82.41,99.72 81.53,99.72 78.82,99.72 77.93,99.72 76.62,99.72 76.41,99.72 75.78,99.72 75.56,99.72 73.22,99.87 72.49,99.87 69.62,99.87 68.89,99.87 67.73,99.87 67.52,99.87 66.88,99.87 66.67,99.87 64.33,99.87 63.6,99.87 60.73,99.87 60,99.87 58.84,99.87 58.63,99.87 58,99.87 57.78,99.87 55.44,99.87 54.71,99.87 51.84,99.87 51.11,99.87 49.96,100.18 49.74,100.18 49.1,100.18 48.89,100.18 46.55,100.33 45.82,100.33 44.78,98.5 44.78,93.71 44.78,91.28 44.78,90.12 44.78,87.68 44.78,86.52 44.78,84.09 44.78,72.11 45.51,70.09 45.92,70.05 47.19,70.05 47.68,70.13 48.89,70.17 49.1,70.2 49.74,70.29 49.96,70.32 50.96,70.42 51.55,70.48 54.21,70.7 54.45,70.69 55.17,70.64 55.41,70.63 56.12,70.6 56.35,70.6 57.01,70.59 57.2,70.59 57.78,70.58 58,70.58 58.63,70.56 58.84,70.56 59.85,70.5 60.43,70.46 63.33,70.2 63.79,70.09 66.63,69.24 66.85,69.19 67.48,69.02 67.69,68.95 68.6,68.68 69.09,68.53 71.98,67.57 72.12,67.5 72.54,67.3 72.82,67.16 75.49,65.84 75.71,65.74 76.27,65.44 76.41,65.37 76.96,65.24 77.03,65.26 77.57,65.42 78.05,65.56 81.11,66.39 81.55,66.45 84.47,66.86 84.68,66.89 85.32,66.96 85.53,66.98 86.38,67.05 86.81,67.09 89.86,67.44 90.19,67.43 91.42,67.38 91.99,67.36 93.34,67.32 93.55,67.31 94.19,67.29 94.41,67.27 94.94,67.24 95.04,67.23 95.62,67.25 95.99,67.28 98.73,67.45 99.03,67.43 100.24,67.38 100.83,67.36 102.23,67.32 102.44,67.31 103.08,67.28 103.3,67.27 106.15,67.04 108.67,66.84 111.41,66.53 111.72,66.43 113.3,66.52 114.09,67.06 115.96,68.3 116.31,68.53 116.96,69.13 117,69.16 119.65,70.65 121.13,71.47 122.51,72.23 122.55,72.25 124.06,72.69 125.44,73.08 127.26,73.58 127.61,73.67 128.37,74.01 128.47,74.03 130.88,74.43 133.83,74.9 135.25,75.12 135.47,75.16 136.1,75.28 136.31,75.33 137.92,75.71 140.42,76.33 142.03,76.85 142.25,76.97 143.53,77.67 145.26,78.63 146.4,79.22 146.44,79.21 146.69,79.36 146.9,79.35 147.53,79.34 147.75,79.34 148.42,79.34 148.54,79.34 149.14,79.34 149.61,79.33 151.51,79.41 151.85,79.37 154.22,79.34 156.66,79.55 158.08,79.66 158.3,79.68 158.75,79.73 158.79,79.73 159.5,80.54 161.73,82.95 163.29,84.79 164.11,85.84 165.1,86.77 165.1,86.92 165.1,98.43 165.1,99.06 165.1,99.69 L1-1:U1.3
L1-1:N$5